# EAGLE design usb_blaster (EAGLE 7.3.0)
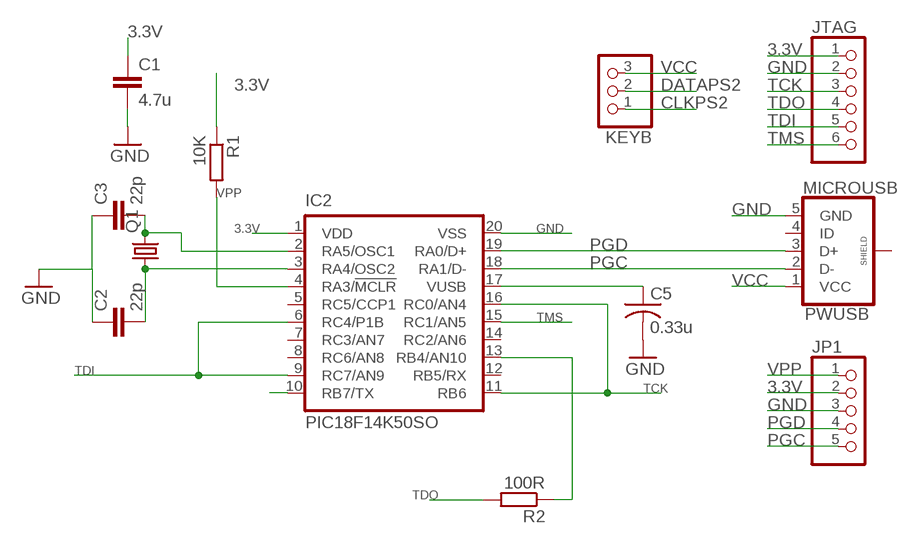
[diagram p0: schematic, sheet 1]

## Parts
C1  4.7u  C-EUC0805  [C0805]
C2  22p  C-EUC0805  [C0805]
C3  22p  C-EUC0805  [C0805]
C5  0.33u  C-USC0805  [C0805]
IC2  PIC18F14K50SO  [SO20]
JP1  PINHD-1X5  [1X05]
JTAG  PINHD-1X6  [1X06]
KEYB  PINHD-1X3  [1X03]
PWUSB  MICROUSB  [MICRO_USB_1PRIMARY]
Q1  CRYSTALHC49UP  [HC49UP]
R1  10K  R-EU_R0805  [R0805]
R2  100R  R-EU_R0805  [R0805]

## Nets
3.3V: C1.1 IC2.1(VDD) JP1.2 JTAG.1 R1.1
CLKPS2: KEYB.1
DATAPS2: KEYB.2
GND: C1.2 C2.1 C3.1 C5.2 IC2.20(VSS) JP1.3 JTAG.2 PWUSB.5(GND)
N$1: C3.2 IC2.2(RA5/OSC1) Q1.2
N$4: C2.2 IC2.3(RA4/OSC2) Q1.1
N$7: IC2.13(RB4/AN10) R2.1
N$12: C5.1 IC2.17(VUSB)
N$14: IC2.10(RB7/TX)
PGC: IC2.18(RA1/D-) JP1.5 PWUSB.2(D-)
PGD: IC2.19(RA0/D+) JP1.4 PWUSB.3(D+)
TCK: IC2.11(RB6) IC2.16(RC0/AN4) JTAG.3
TDI: IC2.6(RC4/P1B) IC2.9(RC7/AN9) JTAG.5
TDO: JTAG.4 R2.2
TMS: IC2.15(RC1/AN5) JTAG.6
VCC: KEYB.3 PWUSB.1(VCC)
VPP: IC2.4(RA3/!MCLR!) JP1.1 R1.2
Unconnected: IC2.5(RC5/CCP1) IC2.7(RC3/AN7) IC2.8(RC6/AN8) IC2.12(RB5/RX) IC2.14(RC2/AN6) PWUSB.4(ID) PWUSB.6(SHIELD)

## Library data of the parts
C1-C3 = rcl:C-EU: CAPACITOR, European symbol
C5 = rcl:C-US: CAPACITOR, American symbol
IC2 = pic18f14k50:PIC18F14K50
JP1 = pinhead:PINHD-1X5: PIN HEADER
JTAG = pinhead:PINHD-1X6: PIN HEADER
KEYB = pinhead:PINHD-1X3: PIN HEADER
PWUSB = zxuno_rev_mcleod:MICROUSB
Q1 = crystal:CRYSTAL: CRYSTAL; OC_FARNELL: unknown; OC_NEWARK: unknown
R1 R2 = rcl:R-EU_: RESISTOR, European symbol

## Net classes
0 default: clearance 0.205 mm

## Board
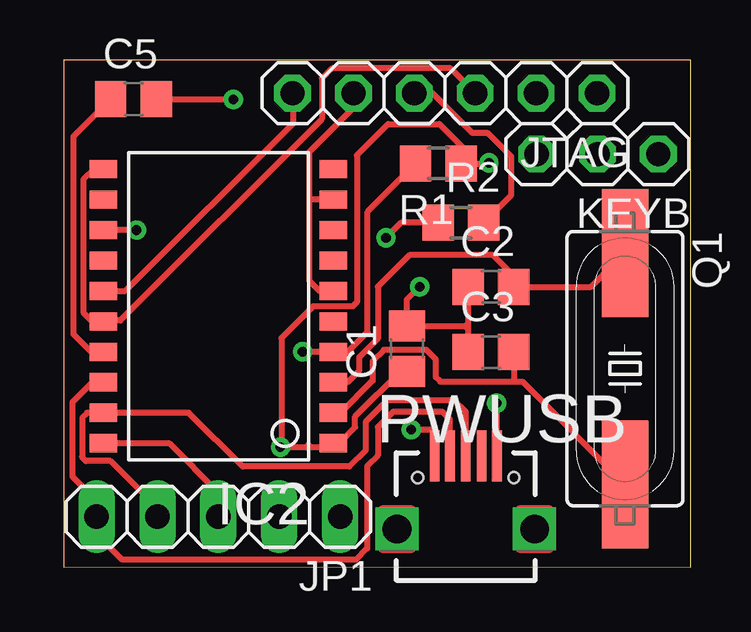
[diagram p1: board, top side]
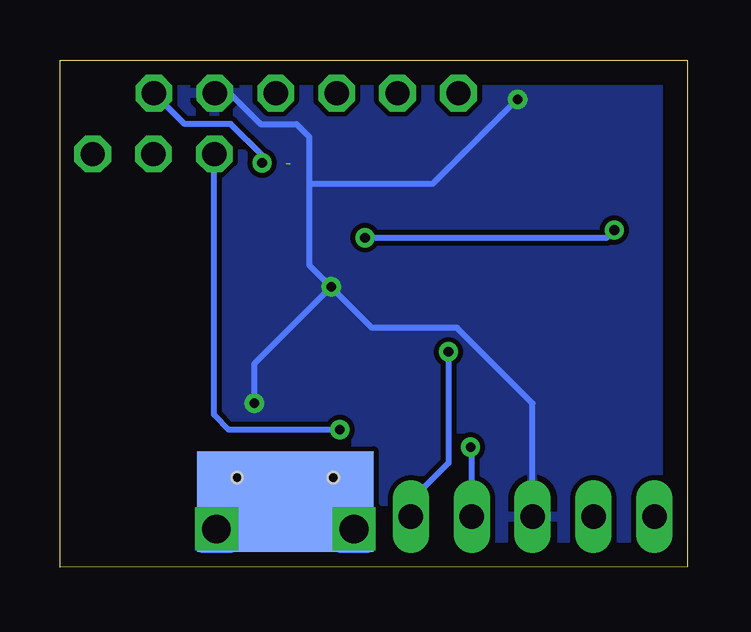
[diagram p2: board, bottom side, seen from below]

Size 26.16 x 21.15 mm. Coordinates in mm from the lower left corner, seen from the top.
Outline: 0.01,0.01 26.16,0 26.15,21.14 0,21.15 0.01,0.01
Copper layers (1*16): Top 0.035mm / dielectric 1.5mm / Bottom 0.035mm
Design rules "default": minimum track width 10mil, minimum drill 24mil, track to track 8mil, track to pad 8mil, pad to pad 8mil, via to via 8mil, smd to smd 8mil, copper to edge 40mil, drill to drill 8mil, minimum pad ring 10mil, minimum via ring 8mil, stop-mask expansion 4mil, vias tented up to drill 0mil, thermal gap 10mil

### Footprints (pad centres in the part's own frame; a part is rotated, then mirrored left to right if it is on the bottom)
C0805 = smd 1.3 x 1.5: 1 -0.95,0; 2 0.95,0
SO20 = smd 0.762 x 1.143: 1 -5.08,-4.788; 2 -3.81,-4.788; 3 -2.54,-4.788; 4 -1.27,-4.788; 5 0,-4.788; 6 1.27,-4.788; 7 2.54,-4.788; 8 3.81,-4.788; 9 5.08,-4.788; 10 6.35,-4.788; 11 6.35,4.788; 12 5.08,4.788; 13 3.81,4.788; 14 2.54,4.788; 15 1.27,4.788; 16 0,4.788; 17 -1.27,4.788; 18 -2.54,4.788; 19 -3.81,4.788; 20 -5.08,4.788
1X05 = drill 1.016 long: 1 -5.08,0; 2 -2.54,0; 3 0,0; 4 2.54,0; 5 5.08,0
1X06 = drill 1.016 octagon: 1 -6.35,0; 2 -3.81,0; 3 -1.27,0; 4 1.27,0; 5 3.81,0; 6 6.35,0
1X03 = drill 1.016 octagon: 1 -2.54,0; 2 0,0; 3 2.54,0
MICRO_USB_1PRIMARY = smd 0.406 x 2.108: 1 -1.295,0.381; 2 -0.66,0.381; 3 0,0.381; 4 0.66,0.381; 5 1.295,0.381 | smd 7.366 x 4.191 bottom: 6 0,-1.524 | drill 1.194 pad 1.538 square: 7 -2.87,-2.667; 8 2.87,-2.667 | hole 0.457: -2.007,-0.533; 2.007,-0.533
HC49UP = smd 5.334 x 1.93: 1 -4.826,0; 2 4.826,0
R0805 = smd 1.3 x 1.5: 1 -0.95,0; 2 0.95,0

### Placement (x,y rotation side)
C1  14.31,9.12 90 top
C2  17.81,11.69 0 top
C3  17.81,8.97 0 top
C5  2.91,19.52 0 top
IC2  6.45,10.25 90 top
JP1  6.45,2.1 180 top
JTAG  15.89,19.77 180 top
KEYB  22.25,17.23 180 top
PWUSB  16.76,4.26 0 top
Q1  23.4,8.28 270 top
R1  15.62,16.83 180 top
R2  16.56,14.37 0 top

### Tracks (layer width: path | path; a pad name or v marks a point on that pad's centre or on a via)
3.3V  (via drill 0.4)  (1 unrouted)
  Top 0.254: 10.21,10.69 10.41,10.88 12.05,10.88 12.22,11.05 12.22,17.18 13.52,18.48 15.66,18.48 16.72,17.42 16.72,16.83 17.7,16.83 v17.73,16.86 | R1.1 | C1.1 14.03,8.16 12.16,6.29 12.16,5.84 11.49,5.17 IC2.1 11.07,5.01 10.13,5.01 | 10.13,5.01 v9.04,5.01 9.08,5.05 9.08,9.56 10.21,10.69 | 10.21,5.09 10.13,5.01 | 10.21,10.69
  Bottom 0.254: JP1.2 8.99,4.96 v9.04,5.01 | v17.73,16.86 17.73,17.18 19.03,18.48 20.95,18.48 JTAG.1
GND  (via drill 0.4)
  Top 0.254: IC2.20 1.67,5.16 4.42,5.16 6.45,3.13 JP1.3 | PWUSB.5 18.06,6.43 v18.05,6.84 | C5.2 7.06,19.52 v7.07,19.51 | C2.1 16.86,9.94 | 16.86,9.94 C3.1 | 16.86,9.94 16.74,10.06 C1.2 14.31,11.16 v14.85,11.69
  Bottom 0.254: v7.07,19.51 7.1,19.51 10.62,15.98 15.74,15.98 15.76,15.96 | JTAG.2 19.08,19.77 17.79,18.48 16.3,18.48 15.76,17.95 15.76,15.96 | JP1.3 6.45,6.84 9.59,9.98 13.14,9.98 v14.85,11.69 | 15.76,15.96 15.76,12.61 v14.85,11.69 | v18.05,6.84 18.05,8.49 v14.85,11.69
  pour Bottom: 0.26,20.86 25.81,20.91 25.93,0.37 0.33,0.34
N$1
  Top 0.254: IC2.2 11.54,6.44 12.88,7.78 12.88,8.6 13.35,9.06 15.12,9.06 15.51,8.68 15.51,7.93 15.7,7.74 18.77,7.74 | 18.77,7.74 19.11,7.74 Q1.2 | C3.2 18.76,7.75 18.77,7.74
N$4
  Top 0.254: IC2.3 11.83,7.71 12.33,8.21 12.33,8.77 13.1,9.53 13.1,11.7 14.41,13.01 17.9,13.01 18.76,12.15 C2.2 21.98,11.69 Q1.1
N$7  (via drill 0.4)
  Top 0.254: 13.47,13.77 v13.44,13.74 14.06,14.37 R2.1 | v3.04,14.06 IC2.13
  Bottom 0.254: v13.44,13.74 3.36,13.74 v3.04,14.06
N$12
  Top 0.254: IC2.17 1.14,8.98 0.41,9.71 0.41,17.97 C5.1
PGC
  Top 0.254: PWUSB.2 16.1,6.16 15.79,6.48 13.74,6.48 13.1,5.84 13.1,4.67 12.65,4.22 12.65,0.78 12.18,0.31 2.44,0.31 1.37,1.38 JP1.5 1.37,2.77 0.37,3.77 0.37,6.89 1.19,7.71 IC2.18
PGD
  Top 0.254: PWUSB.3 16.76,6.49 16.3,6.95 13.48,6.95 12.58,6.05 12.58,4.88 11.9,4.2 7.46,4.2 5.22,6.44 IC2.19 0.97,6.44 0.78,6.25 0.78,4.62 0.75,4.6 0.93,4.43 1.95,4.43 3.91,2.47 JP1.4
TCK
  Top 0.254: IC2.11 1.24,16.6 0.82,16.18 0.82,10.62 1.19,10.25 IC2.16 1.69,10.28 2.36,10.28 10.77,18.69 10.77,20.38 11.19,20.81 16.13,20.81 JTAG.3
TDI
  Top 0.254: JTAG.5 12.08,19.15 10.23,17.31 10.23,15.32 | 10.23,15.32 10.23,11.95 10.66,11.52 IC2.6 | IC2.9 10.24,15.33 10.23,15.32
TDO
  Top 0.254: JTAG.4 15.37,19.77 17.02,18.12 17.66,18.12 18.65,17.14 18.65,15.5 R2.2
TMS
  Top 0.254: IC2.15 2.57,11.52 9.57,18.52 9.57,19.74 JTAG.6
VCC  (via drill 0.4)
  Top 0.254: PWUSB.1 15.47,5.6 15.34,5.73 v14.48,5.73
  Bottom 0.254: v14.48,5.73 19.12,5.73 19.74,6.35 19.74,17.2 KEYB.3
VPP  (via drill 0.4)
  Top 0.254: R1.2 12.67,14.82 12.67,9.8 11.84,8.98 IC2.4 v9.96,8.98
  Bottom 0.254: v9.96,8.98 9.96,4.35 11.54,2.77 11.54,2.11 JP1.1

### Text on the board
200bmp: C:/Users/erdem/Pictures/altera-jtag.bmp